# EAGLE schematic untitled (EAGLE 6.6.0)
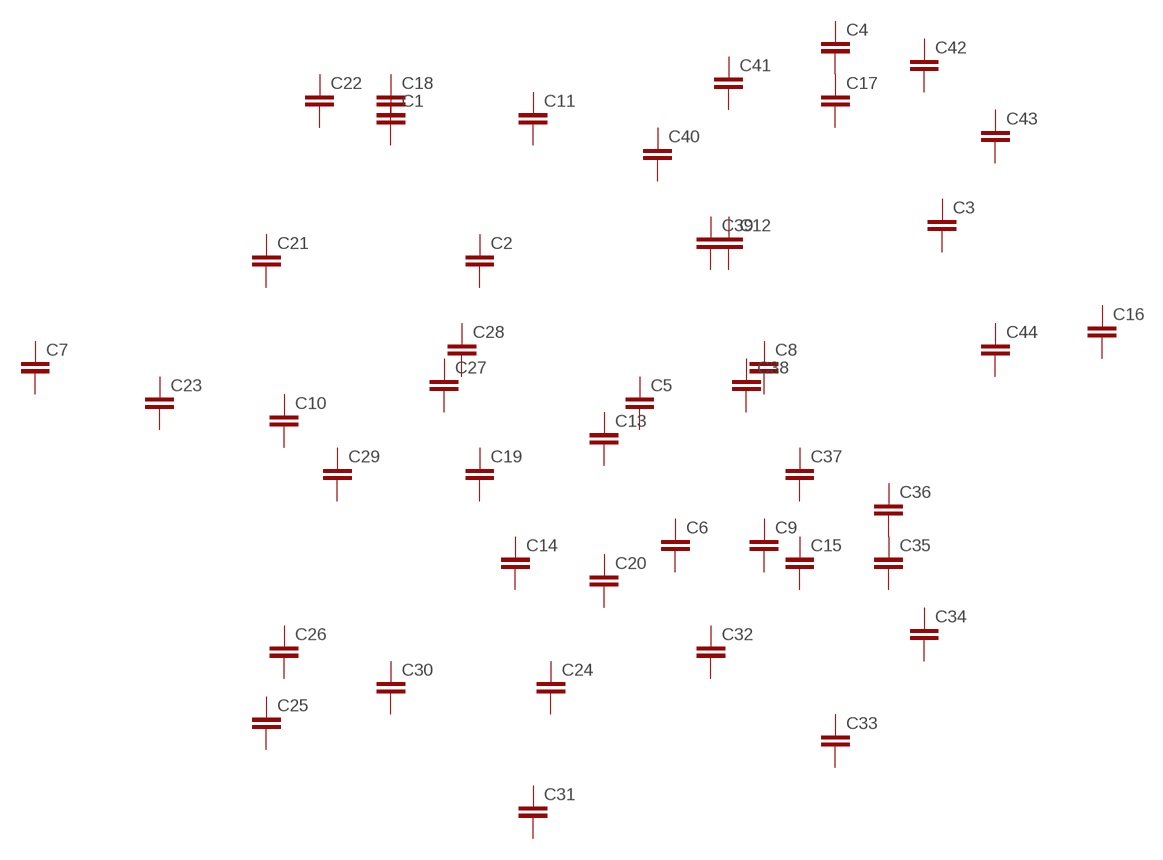
[diagram p0: schematic, sheet 1]

## Parts
C1  C-EU025-024X044  [C025-024X044]
C2  C-EU025-024X044  [C025-024X044]
C3  C-EU025-024X044  [C025-024X044]
C4  C-EU025-024X044  [C025-024X044]
C5  C-EU025-024X044  [C025-024X044]
C6  C-EU025-024X044  [C025-024X044]
C7  C-EU025-024X044  [C025-024X044]
C8  C-EU025-024X044  [C025-024X044]
C9  C-EU025-024X044  [C025-024X044]
C10  C-EU025-024X044  [C025-024X044]
C11  C-EU025-024X044  [C025-024X044]
C12  C-EU025-024X044  [C025-024X044]
C13  C-EU025-024X044  [C025-024X044]
C14  C-EU025-024X044  [C025-024X044]
C15  C-EU025-024X044  [C025-024X044]
C16  C-EU025-024X044  [C025-024X044]
C17  C-EU025-024X044  [C025-024X044]
C18  C-EU025-024X044  [C025-024X044]
C19  C-EU025-024X044  [C025-024X044]
C20  C-EU025-024X044  [C025-024X044]
C21  C-EU025-024X044  [C025-024X044]
C22  C-EU025-024X044  [C025-024X044]
C23  C-EU025-024X044  [C025-024X044]
C24  C-EU025-024X044  [C025-024X044]
C25  C-EU025-024X044  [C025-024X044]
C26  C-EU025-024X044  [C025-024X044]
C27  C-EU025-024X044  [C025-024X044]
C28  C-EU025-024X044  [C025-024X044]
C29  C-EU025-024X044  [C025-024X044]
C30  C-EU025-024X044  [C025-024X044]
C31  C-EU025-024X044  [C025-024X044]
C32  C-EU025-024X044  [C025-024X044]
C33  C-EU025-024X044  [C025-024X044]
C34  C-EU025-024X044  [C025-024X044]
C35  C-EU025-024X044  [C025-024X044]
C36  C-EU025-024X044  [C025-024X044]
C37  C-EU025-024X044  [C025-024X044]
C38  C-EU025-024X044  [C025-024X044]
C39  C-EU025-024X044  [C025-024X044]
C40  C-EU025-024X044  [C025-024X044]
C41  C-EU025-024X044  [C025-024X044]
C42  C-EU025-024X044  [C025-024X044]
C43  C-EU025-024X044  [C025-024X044]
C44  C-EU025-024X044  [C025-024X044]

## Nets
N$1: C4.2 C17.1
N$2: C35.1 C36.2
Unconnected: C1.1 C1.2 C2.1 C2.2 C3.1 C3.2 C4.1 C5.1 C5.2 C6.1 C6.2 C7.1 C7.2 C8.1 C8.2 C9.1 C9.2 C10.1 C10.2 C11.1 C11.2 C12.1 C12.2 C13.1 C13.2 C14.1 C14.2 C15.1 C15.2 C16.1 C16.2 C17.2 C18.1 C18.2 C19.1 C19.2 C20.1 C20.2 C21.1 C21.2 C22.1 C22.2 C23.1 C23.2 C24.1 C24.2 C25.1 C25.2 C26.1 C26.2 C27.1 C27.2 C28.1 C28.2 C29.1 C29.2 C30.1 C30.2 C31.1 C31.2 C32.1 C32.2 C33.1 C33.2 C34.1 C34.2 C35.2 C36.1 C37.1 C37.2 C38.1 C38.2 C39.1 C39.2 C40.1 C40.2 C41.1 C41.2 C42.1 C42.2 C43.1 C43.2 C44.1 C44.2

## Library data of the parts
C1-C44 = resistor:C-EU: CAPACITOR, European symbol